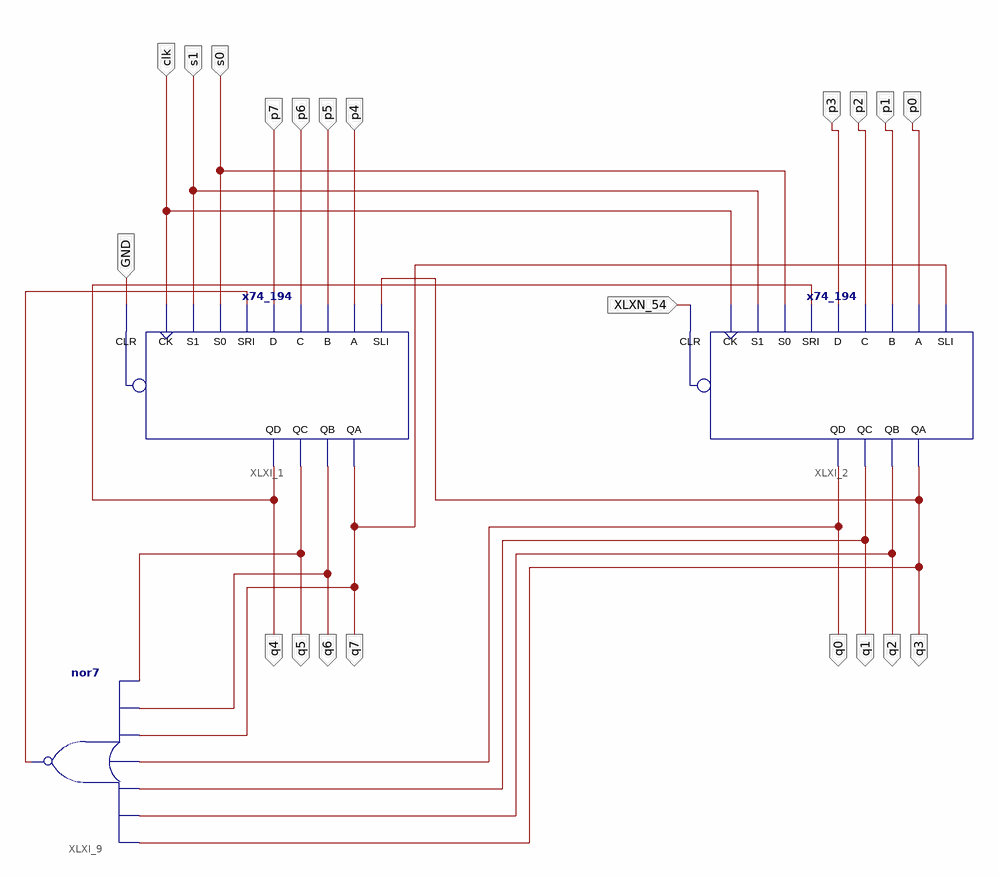
[diagram p0: schematic sheet 1]
// Xilinx ISE schematic lab10_4.sch (xa9500xl) as structural Verilog: 3 symbols, 21 ports
module lab10_4 (
  input  GND,
  input  p6,
  input  p5,
  input  p4,
  input  p3,
  input  p7,
  input  s0,
  input  s1,
  input  clk,
  input  p0,
  input  p1,
  input  p2,
  input  XLXN_54,
  output q1,
  output q5,
  output q6,
  output q3,
  output q2,
  output q0,
  output q4,
  output q7
);

  wire XLXN_58;

  x74_194 XLXI_1 (
    .A(p4), .B(p5), .C(p6), .CK(clk), .CLR(GND), .D(p7), .S0(s0), .S1(s1), .SLI(q3), .SRI(XLXN_58), .QA(q7),
    .QB(q6), .QC(q5), .QD(q4));
  x74_194 XLXI_2 (
    .A(p0), .B(p1), .C(p2), .CK(clk), .CLR(XLXN_54), .D(p3), .S0(s0), .S1(s1), .SLI(q7), .SRI(q4), .QA(q3),
    .QB(q2), .QC(q1), .QD(q0));
  nor XLXI_9 (XLXN_58, q5, q6, q7, q0, q1, q2, q3);
endmodule
